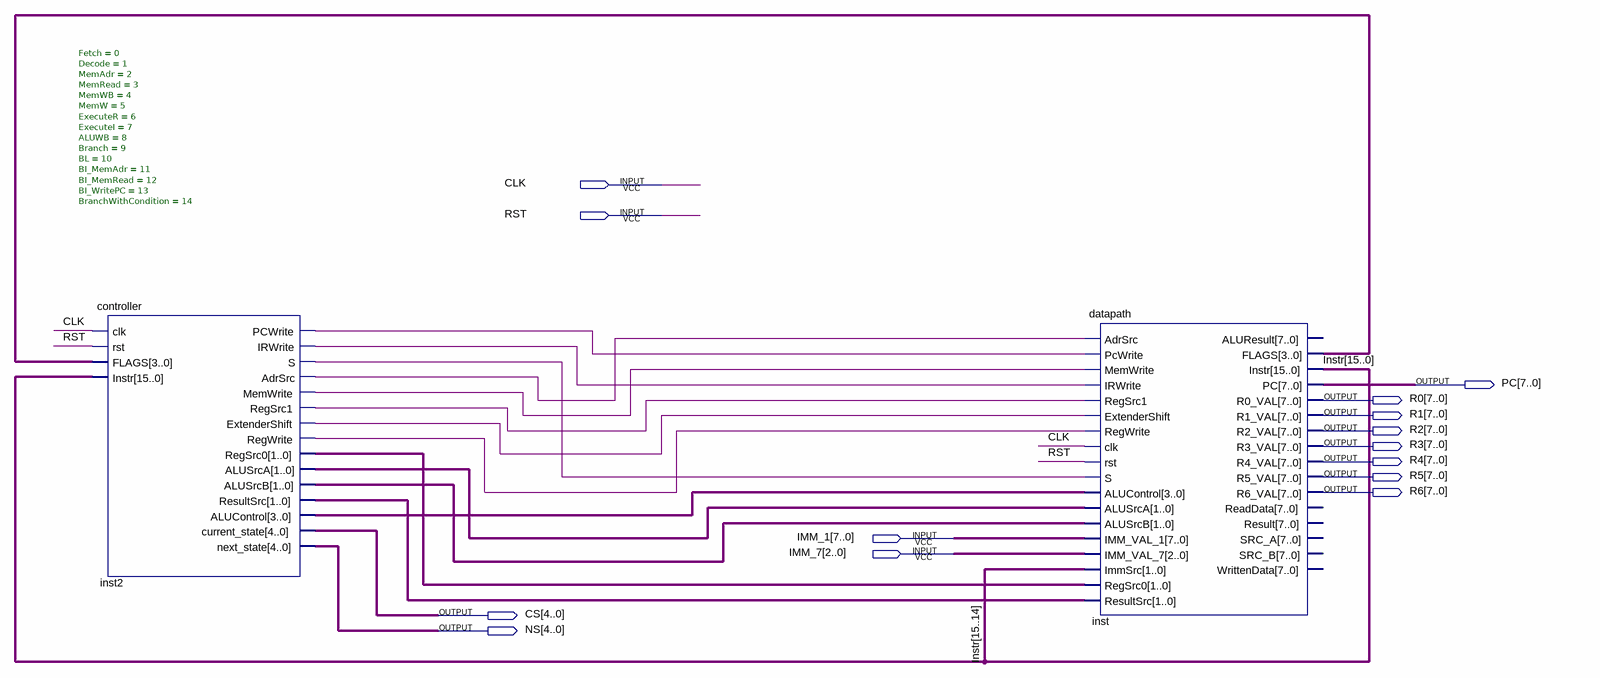
[diagram p0: schematic sheet]
// Quartus schematic main_diagram.bdf as structural Verilog: 2 symbols, 14 pins
module main_diagram (
  input  CLK,
  input  RST,
  input  [7:0] IMM_1,
  input  [2:0] IMM_7,
  output [7:0] PC,
  output [7:0] R0,
  output [7:0] R1,
  output [7:0] R2,
  output [7:0] R3,
  output [7:0] R4,
  output [7:0] R5,
  output [7:0] R6,
  output [4:0] CS,
  output [4:0] NS
);

  wire inst2_adrsrc, inst2_extendershift, inst2_irwrite, inst2_memwrite, inst2_pcwrite, inst2_regsrc1,
       inst2_regwrite, inst2_s;
  wire [1:0] inst2_alusrca, inst2_alusrcb, inst2_regsrc0, inst2_resultsrc;
  wire [3:0] inst2_alucontrol, inst_flags;
  wire [15:0] Instr;

  controller #(.Fetch(0), .Decode(1), .MemAdr(2), .MemRead(3), .MemWB(4), .MemW(5), .ExecuteR(6), .ExecuteI(7), .ALUWB(8), .Branch(9), .BL(10), .BI_MemAdr(11), .BI_MemRead(12), .BI_WritePC(13), .BranchWithCondition(14)) inst2 (
    .clk(CLK), .rst(RST), .FLAGS(inst_flags), .Instr(Instr), .PCWrite(inst2_pcwrite),
    .IRWrite(inst2_irwrite), .S(inst2_s), .AdrSrc(inst2_adrsrc), .MemWrite(inst2_memwrite),
    .RegSrc1(inst2_regsrc1), .ExtenderShift(inst2_extendershift), .RegWrite(inst2_regwrite),
    .RegSrc0(inst2_regsrc0), .ALUSrcA(inst2_alusrca), .ALUSrcB(inst2_alusrcb), .ResultSrc(inst2_resultsrc),
    .ALUControl(inst2_alucontrol), .current_state(CS), .next_state(NS));
  datapath inst (
    .AdrSrc(inst2_adrsrc), .PcWrite(inst2_pcwrite), .MemWrite(inst2_memwrite), .IRWrite(inst2_irwrite),
    .RegSrc1(inst2_regsrc1), .ExtenderShift(inst2_extendershift), .RegWrite(inst2_regwrite), .clk(CLK),
    .rst(RST), .S(inst2_s), .ALUControl(inst2_alucontrol), .ALUSrcA(inst2_alusrca), .ALUSrcB(inst2_alusrcb),
    .IMM_VAL_1(IMM_1), .IMM_VAL_7(IMM_7), .ImmSrc(Instr[15:14]), .RegSrc0(inst2_regsrc0),
    .ResultSrc(inst2_resultsrc), .FLAGS(inst_flags), .Instr(Instr), .PC(PC), .R0_VAL(R0), .R1_VAL(R1),
    .R2_VAL(R2), .R3_VAL(R3), .R4_VAL(R4), .R5_VAL(R5), .R6_VAL(R6));  // open: ALUResult, ReadData, Result, SRC_A, SRC_B, WrittenData
endmodule
